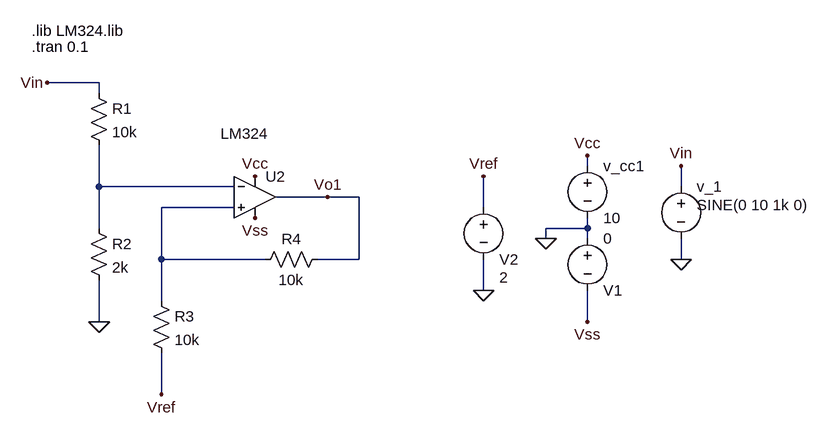
[diagram p0: schematic Lab1_Circuito4.asc]
Lab1_Circuito4.asc, the LTspice schematic file:
Version 4
SHEET 1 1252 740
WIRE -240 16 -320 16
WIRE -240 32 -240 16
WIRE 512 144 512 128
WIRE -240 176 -240 112
WIRE -32 176 -240 176
WIRE 656 176 656 144
WIRE 112 192 32 192
WIRE 160 192 112 192
WIRE -32 208 -144 208
WIRE 352 208 352 160
WIRE -240 240 -240 176
WIRE 512 240 512 224
WIRE 512 240 448 240
WIRE 448 256 448 240
WIRE 512 256 512 240
WIRE -144 288 -144 208
WIRE 16 288 -144 288
WIRE 160 288 160 192
WIRE 160 288 96 288
WIRE 656 288 656 256
WIRE 352 336 352 288
WIRE -144 352 -144 288
WIRE -240 384 -240 320
WIRE 512 384 512 336
WIRE -144 496 -144 432
FLAG 0 224 Vss
FLAG 448 256 0
FLAG 656 288 0
FLAG 512 128 Vcc
FLAG 656 144 Vin
FLAG 512 384 Vss
FLAG 0 160 Vcc
FLAG 112 192 Vo1
FLAG 352 336 0
FLAG 352 160 Vref
FLAG -144 496 Vref
FLAG -240 384 0
FLAG -320 16 Vin
SYMBOL OpAmps\\opamp2 0 128 R0
WINDOW 3 -53 -34 Left 2
SYMATTR Value LM324
SYMATTR InstName U2
SYMBOL voltage 512 128 R0
WINDOW 123 0 0 Left 0
WINDOW 39 0 0 Left 0
SYMATTR InstName v_cc1
SYMATTR Value 10
SYMBOL voltage 656 160 R0
WINDOW 3 24 44 Left 2
WINDOW 123 24 72 Left 2
WINDOW 39 0 0 Left 0
SYMATTR Value SINE(0 10 1k 0)
SYMATTR InstName v_1
SYMBOL voltage 512 240 R0
WINDOW 0 24 96 Left 2
WINDOW 3 24 16 Left 2
WINDOW 123 0 0 Left 0
WINDOW 39 0 0 Left 0
SYMATTR InstName V1
SYMATTR Value 0
SYMBOL res -256 16 R0
SYMATTR InstName R1
SYMATTR Value 10k
SYMBOL res -256 224 R0
SYMATTR InstName R2
SYMATTR Value 2k
SYMBOL res -160 336 R0
SYMATTR InstName R3
SYMATTR Value 10k
SYMBOL res 112 272 R90
WINDOW 0 0 56 VBottom 2
WINDOW 3 32 56 VTop 2
SYMATTR InstName R4
SYMATTR Value 10k
SYMBOL voltage 352 192 R0
WINDOW 0 24 96 Left 2
WINDOW 3 24 124 Left 2
WINDOW 123 0 0 Left 0
WINDOW 39 0 0 Left 0
SYMATTR InstName V2
SYMATTR Value 2
TEXT -344 -64 Left 2 !.lib LM324.lib
TEXT -344 -40 Left 2 !.tran 0.1

The netlist it stands for:
* Lab1_Circuito4.asc
XU2 N002 N001 Vcc Vss Vo1 LM324  ; pins In+ In- V+ V- OUT
v_cc1 Vcc 0 10
v_1 Vin 0 SINE(0 10 1k 0)
V1 0 Vss 0
R1 Vin N001 10k
R2 N001 0 2k
R3 N002 Vref 10k
R4 Vo1 N002 10k
V2 Vref 0 2
.lib LM324.lib
.tran 0.1
.backanno
.end